# Altium schematic sheet 主控.SchDoc
size A4
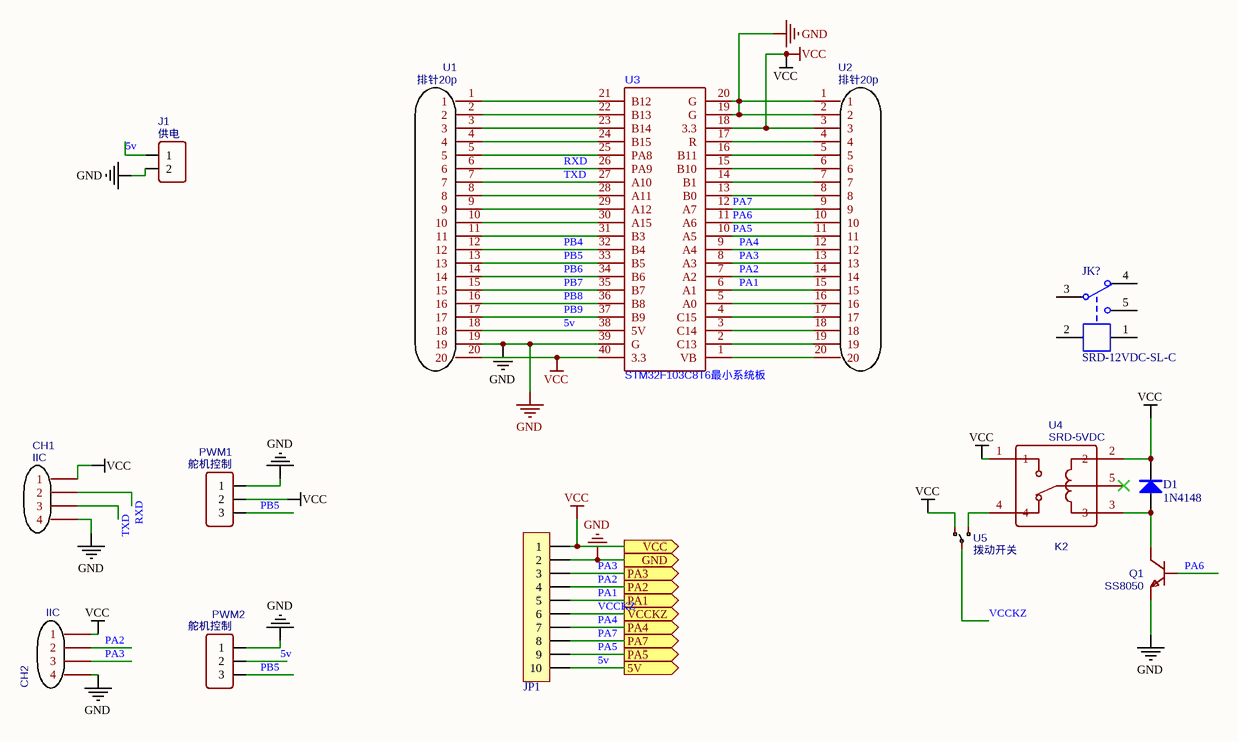
[diagram p0: 主控.SchDoc]

## Parts
CH1  IIC  [HDR2.54-LI-4P]
CH2  IIC  [HDR2.54-LI-4P]
D1  1N4148  [DO-35]
J1  供电  [HDR2.54-WI-2P]
JK?  SRD-12VDC-SL-C  [SRD-C_B]
JP1  HDR-1X10  [MX 1.25-WI-10P]  (value not drawn)
PWM1  舵机控制  [HDR2.54-WI-3P]
PWM2  舵机控制  [HDR2.54-WI-3P]
Q1  SS8050  [TO92A]
U1  排针20p  [HDR2.54-M-LI-20P]
U2  排针20p  [HDR2.54-M-LI-20P]
U3  STM32F103C8T6最小系统板  [PCBComponent_1 - duplicate]
U4  SRD-5VDC  [SRD-C_B]
U5  拨动开关  [SS12D00G3]

## Ports
5V (out), GND (out), PA1 (out), PA2 (out), PA3 (out), PA4 (out), PA5 (out), PA7 (out), VCC (out), VCCKZ (out)

## Nets
GND: CH1.4 CH2.4 J1.2 JP1.2 PWM1.1 PWM2.1 Q1.1(E) U1.19 U2.1 U2.2 U3.19(G) U3.20(G) U3.39(G) ; port GND
VCC: CH1.1 CH2.1 D1.2 JP1.1 PWM1.2 U1.20 U2.3 U3.18(3.3) U3.40(3.3) U4.1 U4.2 U5.3 ; port VCC
5v: J1.1 JP1.10 PWM2.2 U1.18 U3.38(5V) ; port 5V
PA1: JP1.5 U2.15 U3.6(A1) ; port PA1
PA2: CH2.2 JP1.4 U2.14 U3.7(A2) ; port PA2
PA3: CH2.3 JP1.3 U2.13 U3.8(A3) ; port PA3
PA4: JP1.7 U2.12 U3.9(A4) ; port PA4
PA5: JP1.9 U2.11 U3.10(A5) ; port PA5
PA6: Q1.2(B) U2.10 U3.11(A6)
PA7: JP1.8 U2.9 U3.12(A7) ; port PA7
PB4: U1.12 U3.32(B4)
PB5: PWM1.3 PWM2.3 U1.13 U3.33(B5)
PB6: U1.14 U3.34(B6)
PB7: U1.15 U3.35(B7)
PB8: U1.16 U3.36(B8)
PB9: U1.17 U3.37(B9)
RXD: CH1.2 U1.6 U3.26(PA9)
TXD: CH1.3 U1.7 U3.27(A10)
VCCKZ: JP1.6 U5.2 ; port VCCKZ
NetD1_1: D1.1 Q1.3(C) U4.3
NetU1_1: U1.1 U3.21(B12)
NetU1_2: U1.2 U3.22(B13)
NetU1_3: U1.3 U3.23(B14)
NetU1_4: U1.4 U3.24(B15)
NetU1_5: U1.5 U3.25(PA8)
NetU1_8: U1.8 U3.28(A11)
NetU1_9: U1.9 U3.29(A12)
NetU1_10: U1.10 U3.30(A15)
NetU1_11: U1.11 U3.31(B3)
NetU2_4: U2.4 U3.17(R)
NetU2_5: U2.5 U3.16(B11)
NetU2_6: U2.6 U3.15(B10)
NetU2_7: U2.7 U3.14(B1)
NetU2_8: U2.8 U3.13(B0)
NetU2_16: U2.16 U3.5(A0)
NetU2_17: U2.17 U3.4(C15)
NetU2_18: U2.18 U3.3(C14)
NetU2_19: U2.19 U3.2(C13)
NetU2_20: U2.20 U3.1(VB)
NetU4_4: U4.4 U5.1

Not connected (* = marked no-connect by the designer): JK? 1 2 3 4 5; U4 5*

## Notes on the sheet
- (in symbol SRD-5VDC) K2

## Library data of the parts
CH1 CH2 = IIC: Contributor: lzzzzzz; spicePre: U; spiceSymbolName: HANDER*4
D1 = 1N4148: 开关二极管; BOM名称: 高速开关二极管; 卖家免费技术支持，联系售后: 唯一出售店铺网址https://shop463601444.taobao.com; 优秀评价可免费更新: 联系淘宝ID：黄晶宝石，获取更新版封装库; 封装库 来自淘宝卖家 ID：黄晶宝石: 其他店铺购入均为盗版，请立即申请退款
J1 = 供电: Contributor: LCEDA_Lib; BOM_Supplier Part: C124375; BOM_Supplier: LCSC; spicePre: J; spiceSymbolName: HDR-M-2.54_1x2
JK? = SRD-12VDC-SL-C: 12V一组转换; BOM名称: 12V继电器; 版权归属: 封装库来自淘宝卖家 ID：黄晶宝石; 卖家免费技术支持，联系售后: 唯一出售店铺网址https://shop463601444.taobao.com; 封装库来自淘宝卖家 ID：黄晶宝石: 其他店铺购入均为假冒，请立即申请退款，本店现金奖励
JP1 = Header 10: 10P接插件; 卖家免费技术支持，联系售后: 唯一出售店铺网址https://shop463601444.taobao.com; 封装库来自淘宝卖家 ID：黄晶宝石: 其他店铺购入均为假冒，请申请退款，本店现金奖励; 优秀评价可免费更新封装库: 联系淘宝ID：黄晶宝石，获取更新版封装库; BOM名称: 10P接插件
PWM1 PWM2 = 舵机控制: Contributor: LCEDA_Lib; BOM_Supplier Part: C180248; BOM_Supplier: LCSC; spicePre: J; spiceSymbolName: HDR-M-2.54_1x3
Q1 = SS8050: BOM_Manufacturer: CJ; BOM_Supplier: LCSC; BOM_Manufacturer Part: SS8050; image: //image.lceda.cn/szlcsc/C80297.jpg; BOM_Supplier Part: C80297; spicePre: Q; spiceSymbolName: SS8050
U1 U2 = 排针20p: Contributor: liugj; spicePre: U; spiceSymbolName: 排针20p
U4 = SRD-5VDC: Contributor: Jensen; spicePre: U; spiceSymbolName: SRD-5VDC
U5 = 拨动开关: Contributor: ShiKerFamily; BOM_Supplier: LCSC; spicePre: U; spiceSymbolName: 拨动开关-SS12D00G3